# EAGLE design jtag_adapter (EAGLE 5.06)
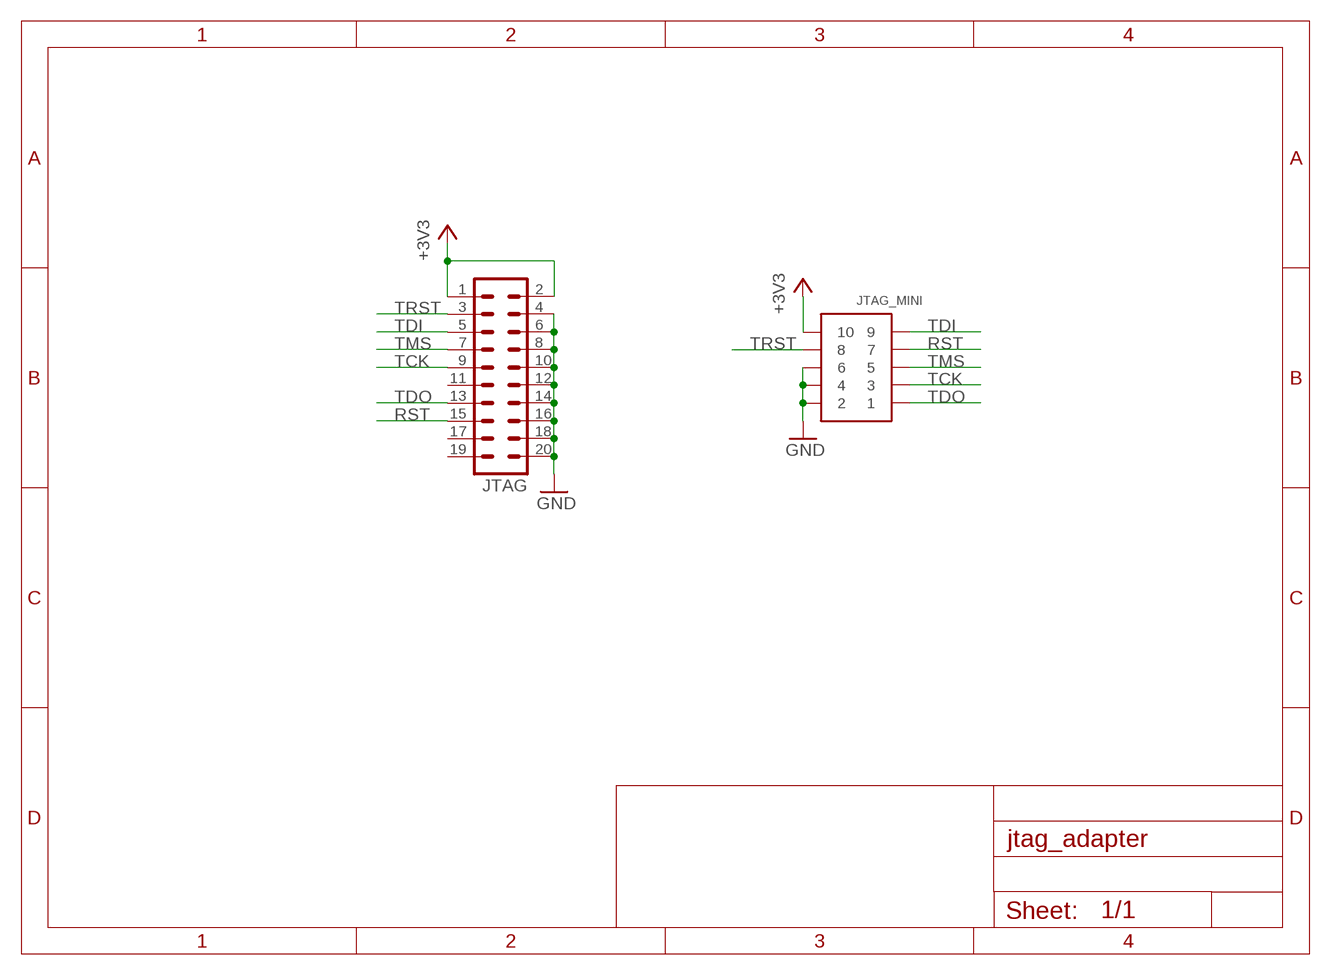
[diagram p0: schematic, sheet 1]

## Parts
JTAG  MA10-2  [MA10-2]
JTAG_MINI  PIN_HDR_EDG_1.27MM_5-2  [PIN_HDR_EDG_1.27MM_5-2]

## Nets
+3V3: JTAG.1 JTAG.2 JTAG_MINI.P$10
GND: JTAG.4 JTAG.6 JTAG.8 JTAG.10 JTAG.12 JTAG.14 JTAG.16 JTAG.18 JTAG.20 JTAG_MINI.P$2 JTAG_MINI.P$4 JTAG_MINI.P$6
RST: JTAG.15 JTAG_MINI.P$7
TCK: JTAG.9 JTAG_MINI.P$3
TDI: JTAG.5 JTAG_MINI.P$9
TDO: JTAG.13 JTAG_MINI.P$1
TMS: JTAG.7 JTAG_MINI.P$5
TRST: JTAG.3 JTAG_MINI.P$8
Unconnected: JTAG.11 JTAG.17 JTAG.19

## Library data of the parts
JTAG = con-lstb:MA10-2: PIN HEADER
JTAG_MINI = open-bldc:PIN_HDR_EDG_1.27MM_5-2

## Net classes
0 default: width 0.152 mm, drill 0.305 mm, clearance 0.152 mm

## Board
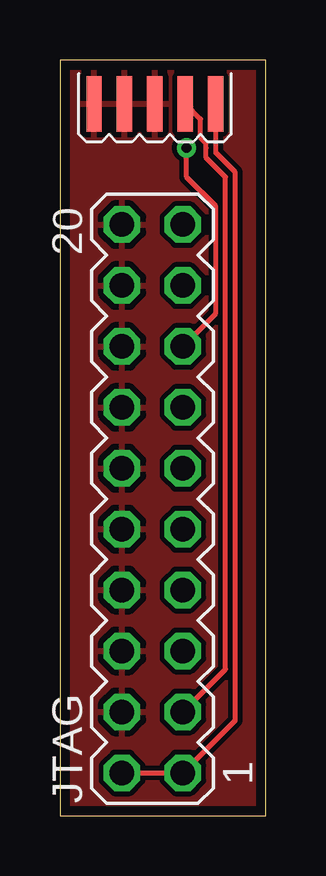
[diagram p1: board, top side]
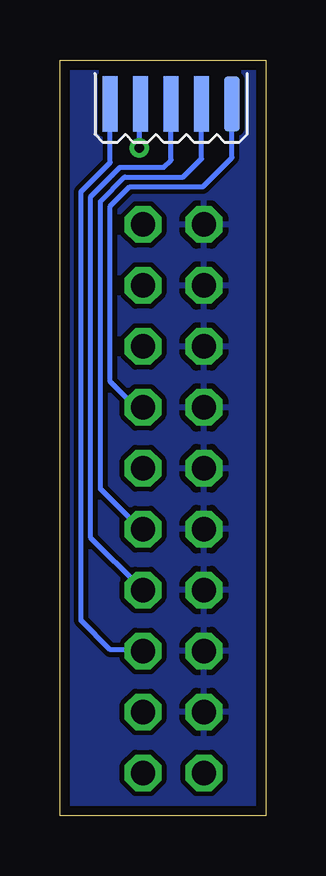
[diagram p2: board, bottom side, seen from below]

Size 8.6 x 31.5 mm. Coordinates in mm from the lower left corner, seen from the top.
Outline: 0,0 8.6,0 8.6,31.5 0,31.5 0,0
Copper layers (1*16): Top 0.035mm / dielectric 1.5mm / Bottom 0.035mm
Design rules "default *": minimum track width 8mil, minimum drill 0.4mm, track to track 8mil, track to pad 8mil, pad to pad 8mil, via to via 8mil, smd to smd 8mil, copper to edge 16mil, drill to drill 8mil, minimum pad ring 8mil, minimum via ring 8mil, stop-mask expansion 4mil, vias tented up to drill 0.4mm, thermal gap 10mil

### Footprints (pad centres in the part's own frame; a part is rotated, then mirrored left to right if it is on the bottom)
MA10-2 = drill 1.016 octagon: 1 -11.43,-1.27; 2 -11.43,1.27; 3 -8.89,-1.27; 4 -8.89,1.27; 5 -6.35,-1.27; 6 -6.35,1.27; 7 -3.81,-1.27; 8 -3.81,1.27; 9 -1.27,-1.27; 10 -1.27,1.27; 11 1.27,-1.27; 12 1.27,1.27; 13 3.81,-1.27; 14 3.81,1.27; 15 6.35,-1.27; 16 6.35,1.27; 17 8.89,-1.27; 18 8.89,1.27; 19 11.43,-1.27; 20 11.43,1.27
PIN_HDR_EDG_1.27MM_5-2 = smd 2.3 x 0.635: P$1 0,0; P$3 0,1.27; P$5 0,2.54; P$7 0,3.81; P$9 0,5.08 | smd 2.3 x 0.635 bottom: P$2 0,0; P$4 0,1.27; P$6 0,2.54; P$8 0,3.81; P$10 0,5.08

### Placement (x,y rotation side)
JTAG  3.86,13.21 90 top
JTAG_MINI  1.42,29.67 90 bottom

### Tracks (layer width: path | path; a pad name or v marks a point on that pad's centre or on a via)
+3V3
  Top 0.203: JTAG.2 JTAG.1 7.32,3.96 7.32,26.82 6.5,27.64 JTAG_MINI.P$10
GND
  pour Bottom: 0,31.5 8.53,31.5 8.53,0 0,0
  pour Top: 0,31.5 8.53,31.5 8.53,0 0,0
RST  (via drill 0.4)
  Top 0.203: JTAG.15 6.5,20.93 6.5,25.4 5.28,26.62 v5.28,27.84
  Bottom 0.203: JTAG_MINI.P$7 5.28,29.62 v5.28,27.84
TCK
  Bottom 0.203: JTAG_MINI.P$3 2.69,27.38 3.45,26.62 5.89,26.62 6.91,25.6 6.91,13.61 5.23,11.94 JTAG.9
TDI
  Bottom 0.203: JTAG_MINI.P$9 6.5,27.23 7.72,26.01 7.72,8.13 6.5,6.91 5.18,6.91 JTAG.5
TDO
  Bottom 0.203: JTAG_MINI.P$1 1.42,27.43 2.64,26.21 5.69,26.21 6.5,25.4 6.5,18.09 5.28,16.87 JTAG.13
TMS
  Bottom 0.203: JTAG_MINI.P$5 3.96,27.33 4.27,27.03 6.1,27.03 7.32,25.81 7.32,11.58 5.28,9.55 JTAG.7
TRST
  Top 0.203: JTAG.3 6.91,6.1 6.91,26.62 6.1,27.43 6.1,27.84 6.1,28.04 5.87,28.27 5.87,29.03 JTAG_MINI.P$8